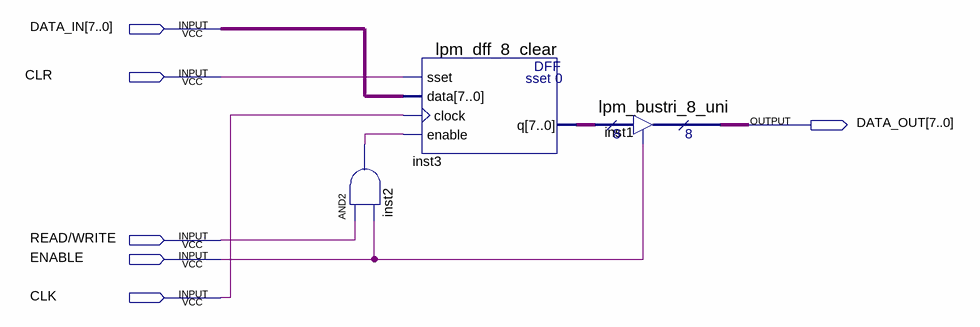
[diagram p0: schematic sheet]
// Quartus schematic register8_clear.bdf as structural Verilog: 3 symbols, 6 pins
module register8_clear (
  input  [7:0] DATA_IN,
  input  CLR,
  input  \READ/WRITE ,
  input  ENABLE,
  input  CLK,
  output [7:0] DATA_OUT
);

  wire inst2_out;
  wire [7:0] inst3_q;

  and inst2 (inst2_out, \READ/WRITE , ENABLE);
  lpm_dff_8_clear inst3 (.sset(CLR), .data(DATA_IN), .clock(CLK), .enable(inst2_out), .q(inst3_q));
  lpm_bustri_8_uni inst1 (.enabledt(ENABLE), .data(inst3_q), .tridata(DATA_OUT));
endmodule
